# EAGLE design MICRO_SQUARED_SENSING_WITH_DIODES (EAGLE 7.5.0)
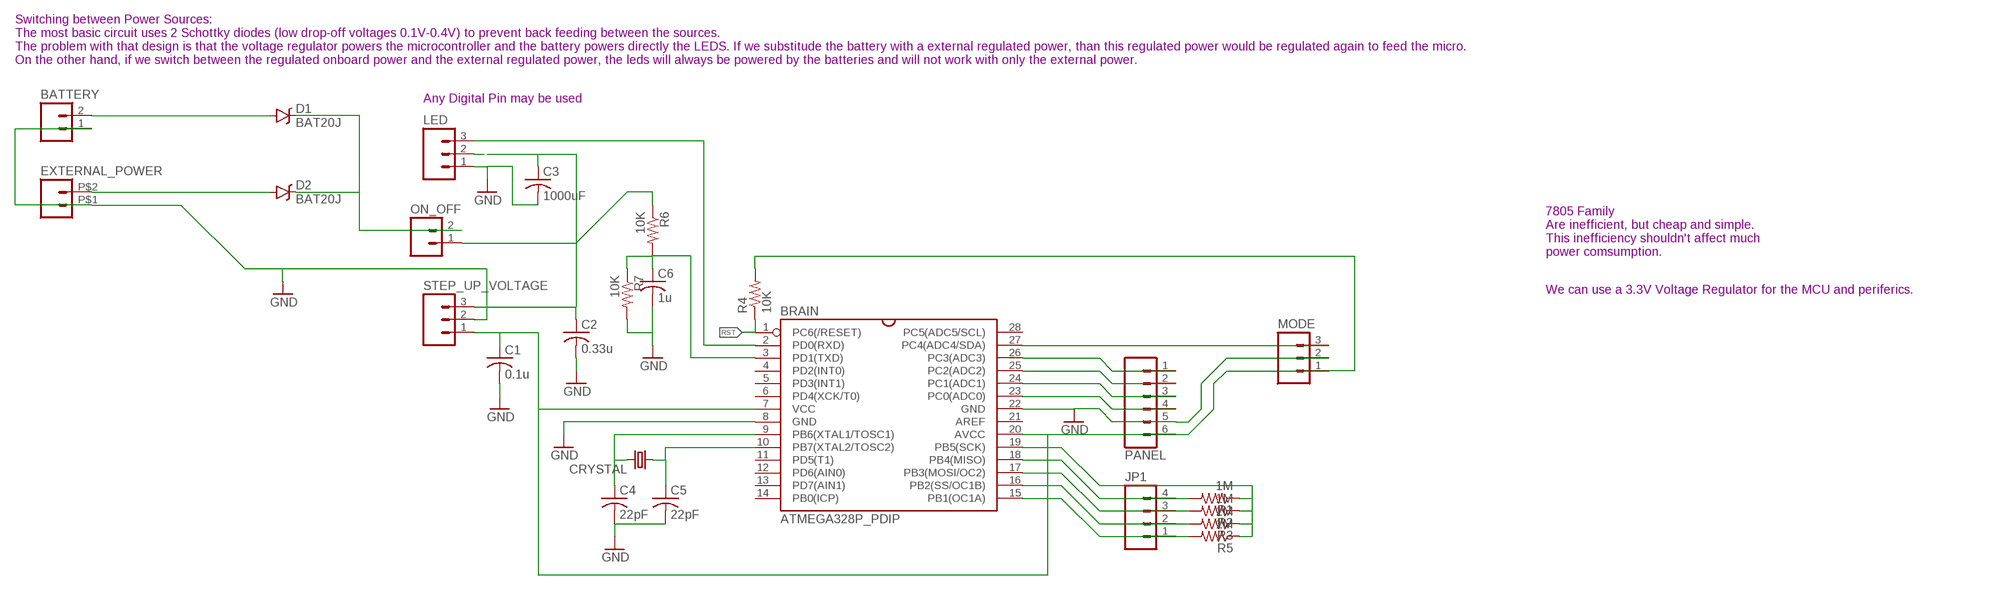
[diagram p0: schematic, sheet 1]

## Parts
BATTERY  M02PTH  [1X02]
BRAIN  ATMEGA328P_PDIP  [DIL-28-3]
C1  0.1u  C-US025-025X050  [C025-025X050]
C2  0.33u  C-US025-025X050  [C025-025X050]
C3  1000uF  C-US050-075X075  [C050-075X075]
C4  22pF  C-US025-024X044  [C025-024X044]
C5  22pF  C-US025-024X044  [C025-024X044]
C6  1u  C-US025-025X050  [C025-025X050]
CRYSTAL  CRYSTALHC49US  [HC49US]
D1  BAT20J  DIODE-SCHOTTKY-BAT20J  [SOD-323]
D2  BAT20J  DIODE-SCHOTTKY-BAT20J  [SOD-323]
EXTERNAL_POWER  M02PTH2  [1X02_BIG]
JP1  M04PTH  [1X04]
LED  M03PTH  [1X03]
MODE  M03PTH  [1X03]
ON_OFF  M02PTH  [1X02]
PANEL  M06NO_SILK_FEMALE_PTH  [1X06_NO_SILK]
R1  1M  RESISTORAXIAL-0.3  [AXIAL-0.3]
R2  1M  RESISTORAXIAL-0.3  [AXIAL-0.3]
R3  1M  RESISTORAXIAL-0.3  [AXIAL-0.3]
R4  10K  RESISTORAXIAL-0.3  [AXIAL-0.3]
R5  1M  RESISTORAXIAL-0.3  [AXIAL-0.3]
R6  10K  RESISTORAXIAL-0.3  [AXIAL-0.3]
R7  10K  RESISTORAXIAL-0.3  [AXIAL-0.3]
STEP_UP_VOLTAGE  M03PTH  [1X03]

## Nets
BLUE_BRAIN: BRAIN.25(PC2(ADC2)) PANEL.2
GND: BATTERY.1 BRAIN.8(GND) BRAIN.22(GND) C1.2 C2.2 C3.2 C4.2 C5.2 C6.2 EXTERNAL_POWER.P$1 LED.1 MODE.2 PANEL.5 R7.P$2 STEP_UP_VOLTAGE.2
GREEN_BRAIN: BRAIN.24(PC1(ADC1)) PANEL.3
LEDS_BRAIN: BRAIN.2(PD0(RXD)) LED.3
N$1: BRAIN.3(PD1(TXD)) C6.1 R6.P$2 R7.P$1
N$2: BRAIN.15(PB1(OC1A)) JP1.1 R5.P$2
N$3: BRAIN.16(PB2(SS/OC1B)) JP1.2 R3.P$2
N$4: BRAIN.17(PB3(MOSI/OC2)) JP1.3 R2.P$2
N$5: BRAIN.18(PB4(MISO)) JP1.4 R1.P$2
N$6: BRAIN.19(PB5(SCK)) R1.P$1 R2.P$1 R3.P$1 R5.P$1
N$7: BRAIN.9(PB6(XTAL1/TOSC1)) C4.1 CRYSTAL.2
N$8: BRAIN.10(PB7(XTAL2/TOSC2)) C5.1 CRYSTAL.1
N$10: D2.A EXTERNAL_POWER.P$2
N$11: BATTERY.2 D1.A
N$12: D1.C D2.C ON_OFF.2
PANEL_MODE_BRAIN: BRAIN.27(PC4(ADC4/SDA)) MODE.3
RED_BRAIN: BRAIN.26(PC3(ADC3)) PANEL.1
RST: BRAIN.1(PC6(/RESET)) R4.P$1
SPEED_BRAIN: BRAIN.23(PC0(ADC0)) PANEL.4
SWITCH_BRAIN: C2.1 C3.1 LED.2 ON_OFF.1 R6.P$1 STEP_UP_VOLTAGE.3
V_5V: BRAIN.7(VCC) BRAIN.20(AVCC) C1.1 MODE.1 PANEL.6 R4.P$2 STEP_UP_VOLTAGE.1
Unconnected: BRAIN.4(PD2(INT0)) BRAIN.5(PD3(INT1)) BRAIN.6(PD4(XCK/T0)) BRAIN.11(PD5(T1)) BRAIN.12(PD6(AIN0)) BRAIN.13(PD7(AIN1)) BRAIN.14(PB0(ICP)) BRAIN.21(AREF) BRAIN.28(PC5(ADC5/SCL))

## Notes on the sheet
- Switching between Power Sources:
  The most basic circuit uses 2 Schottky diodes (low drop-off voltages 0.1V-0.4V) to prevent back feeding between the sources.
  The problem with that design is that the voltage regulator powers the microcontroller and the battery powers directly the LEDS. If we substitude the battery with a external regulated power, than this regulated power would be regulated again to feed the micro.
  On the other hand, if we switch between the regulated onboard power and the external regulated power, the leds will always be powered by the batteries and will not work with only the external power.
- Any Digital Pin may be used
- 7805 Family
  Are inefficient, but cheap and simple.
  This inefficiency shouldn't affect much
  power comsumption.
- We can use a 3.3V Voltage Regulator for the MCU and periferics.

## Library data of the parts
BATTERY EXTERNAL_POWER ON_OFF = SparkFun-Connectors:M02: Standard 2-pin 0.1" header. Use with - straight break away headers ( PRT-00116) - right angle break away headers (PRT-00553) - swiss pins (PRT-00743) - machine pins (PRT-00117) - female headers (PRT-00115) Molex polarized connector foot print use with: PRT-08233 with associated crimp pins and housings. 2.54_SCREWTERM for use with PRT-10571. 3.5mm Screw Terminal footprints for PRT-08084 5mm Screw Terminal footprints for use with PRT-08432
BRAIN = RodrigoMarques_Parts:ATMEGA328P_PDIP: uC used in the Arduino 32kb flash, 1k EEPROM, 2k SRAM This is the through-hole version of this chip.
C1-C6 = adafruit:C-US: CAPACITOR, American symbol
CRYSTAL = SparkFun-FreqCtrl:CRYSTAL: Various standard crystals. Proven footprints.
D1 D2 = SparkFun-DiscreteSemi:DIODE-SCHOTTKY: Schottky diodes in SFE's production catalog BAT20J 1A 23V 0.62Vf RB751 120mA 40V 0.37Vf PMEG4005EJ 0.5A 40V 0.42Vf MBRA140 1A 40V 0.5Vf B340A 3A 40V SMA; PROD_ID: DIO-11623
JP1 = SparkFun-Connectors:M04: Header 4 Standard 4-pin 0.1" header. Use with straight break away headers (SKU : PRT-00116), right angle break away headers (PRT-00553), swiss pins (PRT-00743), machine pins (PRT-00117), and female headers (PRT-00115). Molex polarized connector foot print use with SKU : PRT-08231 with associated crimp pins and housings. 1MM SMD Version SKU: PRT-10208
LED MODE STEP_UP_VOLTAGE = SparkFun-Connectors:M03: Header 3 Standard 3-pin 0.1" header. Use with straight break away headers (SKU : PRT-00116), right angle break away headers (PRT-00553), swiss pins (PRT-00743), machine pins (PRT-00117), and female headers (PRT-00115). Molex polarized connector foot print use with SKU : PRT-08232 with associated crimp pins and housings.
PANEL = SparkFun-Connectors:M06: Header 6 Standard 6-pin 0.1" header. Use with straight break away headers (SKU : PRT-00116), right angle break away headers (PRT-00553), swiss pins (PRT-00743), machine pins (PRT-00117), and female headers (PRT-00115). Molex polarized connector foot print use with SKU : PRT-08094 with associated crimp pins and housings. NOTES ON THE VARIANTS LOCK and LOCK_LONGPADS... This footprint was designed to help hold the alignment of a through-hole component (i.e. 6-pin header) while soldering it into place. You may notice that each hole has been shifted either up or down by 0.005 of an inch from it's more standard position (which is a perfectly straight line). This slight alteration caused the pins (the squares in the middle) to touch the edges of the holes. Because they are alternating, it causes a "brace" to hold the component in place. 0.005 has proven to be the perfect amount of "off-center" position when using our standard breakaway headers. Although looks a little odd when you look at the bare footprint, once you have a header in there, the alteration is very hard to notice. Also,if you push a header all the way into place, it is covered up entirely on the bottom side. This idea of altering the position of holes to aid alignment will be further integrated into the Sparkfun Library for other footprints. It can help hold any component with 3 or more connection pins.; PROD_ID: CONN-08437
R1-R7 = SparkFun-Passives:RESISTOR: Resistor Basic schematic elements and footprints for 0603, 1206, and PTH resistors.

## Net classes
0 default: width 0.254 mm

## Board
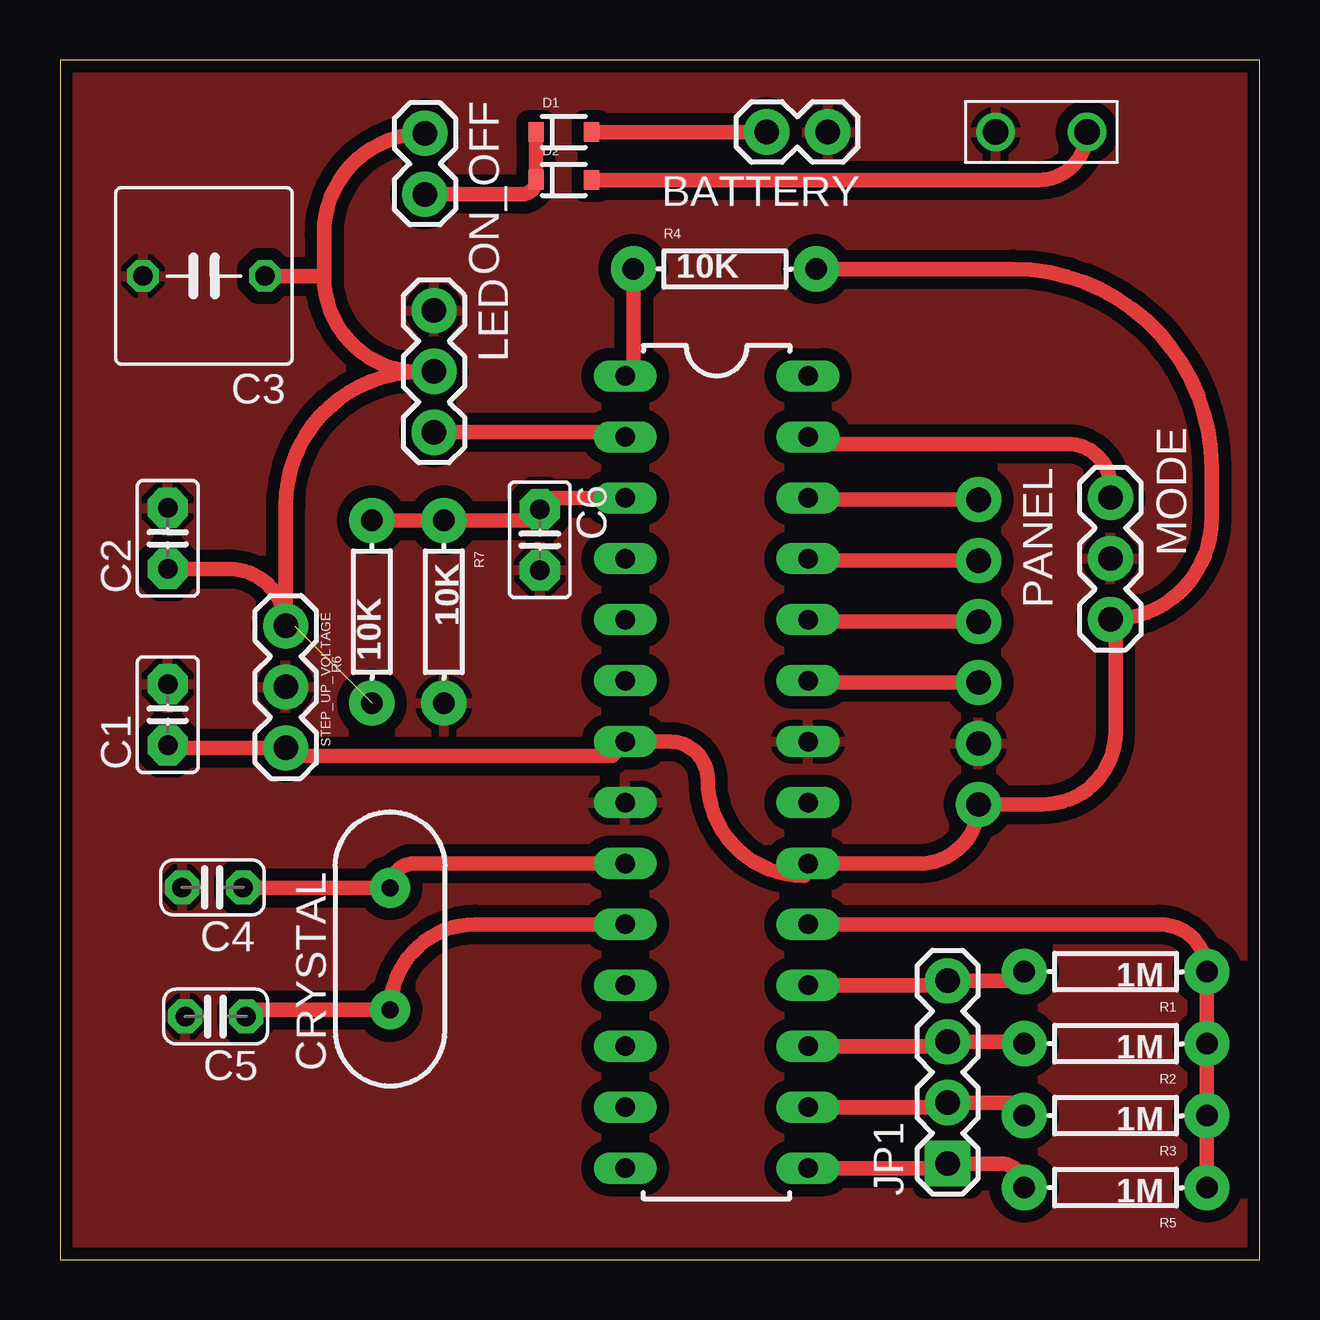
[diagram p1: board, top side]
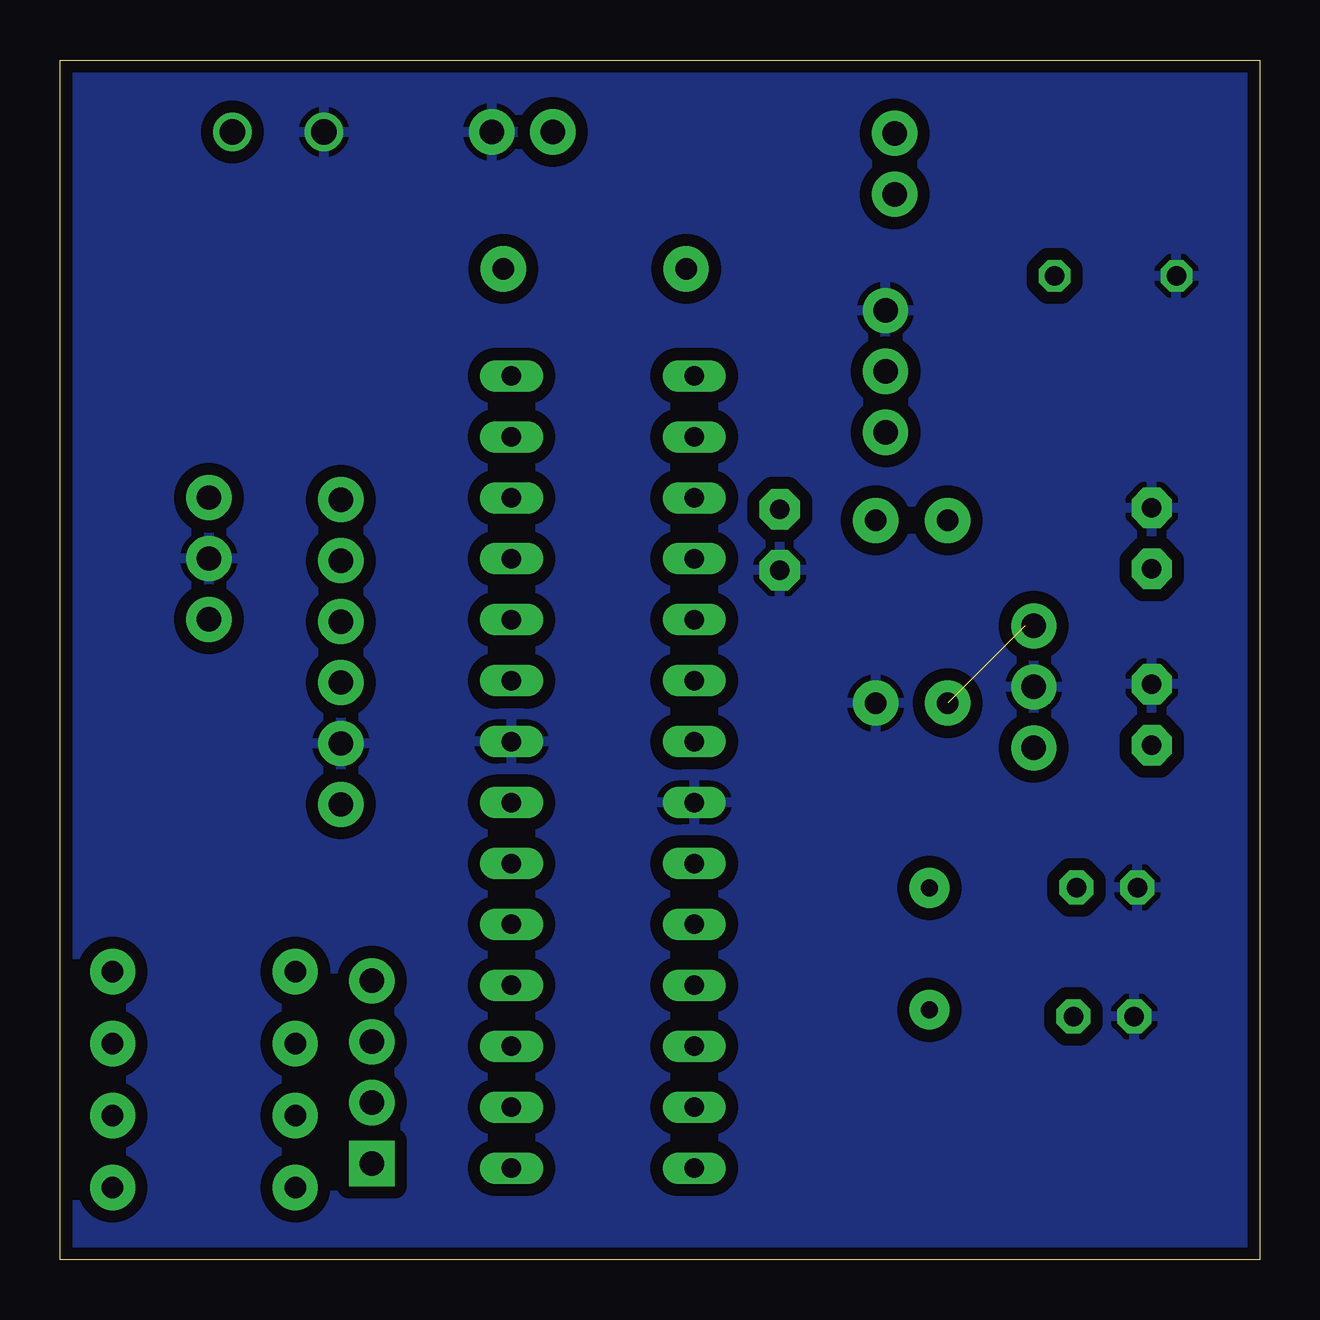
[diagram p2: board, bottom side, seen from below]

Size 50 x 50 mm. Coordinates in mm from the lower left corner, seen from the top.
Outline: 0,0 50,0 50,50 0,50 0,0
Copper layers (1*16): Top 0.035mm / dielectric 1.5mm / Bottom 0.035mm
Design rules "default *": minimum track width 10mil, minimum drill 24mil, track to track 20mil, track to pad 20mil, pad to pad 20mil, via to via 20mil, smd to smd 8mil, copper to edge 20mil, drill to drill 8mil, minimum pad ring 10mil, minimum via ring 8mil, stop-mask expansion 4mil, vias tented up to drill 0mil, thermal gap 10mil

### Footprints (pad centres in the part's own frame; a part is rotated, then mirrored left to right if it is on the bottom)
1X02 = drill 1.016 pad 1.88: 1 0,0; 2 2.54,0
DIL-28-3 = drill 0.813 long: 1 -16.51,-3.81; 2 -13.97,-3.81; 3 -11.43,-3.81; 4 -8.89,-3.81; 5 -6.35,-3.81; 6 -3.81,-3.81; 7 -1.27,-3.81; 8 1.27,-3.81; 9 3.81,-3.81; 10 6.35,-3.81; 11 8.89,-3.81; 12 11.43,-3.81; 13 13.97,-3.81; 14 16.51,-3.81; 15 16.51,3.81; 16 13.97,3.81; 17 11.43,3.81; 18 8.89,3.81; 19 6.35,3.81; 20 3.81,3.81; 21 1.27,3.81; 22 -1.27,3.81; 23 -3.81,3.81; 24 -6.35,3.81; 25 -8.89,3.81; 26 -11.43,3.81; 27 -13.97,3.81; 28 -16.51,3.81
C025-025X050 = drill 0.813 pad 1.676 octagon: 1 -1.27,0; 2 1.27,0
C050-075X075 = drill 0.813 octagon: 1 -2.54,0; 2 2.54,0
C025-024X044 = drill 0.813 pad 1.422 octagon: 1 -1.27,0; 2 1.27,0
HC49US = drill 0.7 pad 1.651: 1 -2.54,0; 2 2.54,0
SOD-323 = smd 0.63 x 0.83: A 1.15,0; C -1.15,0
1X02_BIG = drill 1.067: P$1 0,0; P$2 3.81,0
1X04 = drill 1.016 pad 1.88 square: 1 0,0 | drill 1.016 pad 1.88: 2 2.54,0; 3 5.08,0; 4 7.62,0
1X03 = drill 1.016 pad 1.88: 1 0,0; 2 2.54,0; 3 5.08,0
1X06_NO_SILK = drill 1.016 pad 1.88: 1 0,0; 2 2.54,0; 3 5.08,0; 4 7.62,0; 5 10.16,0; 6 12.7,0
AXIAL-0.3 = drill 0.9 pad 1.88: P$1 -3.81,0; P$2 3.81,0

### Placement (x,y rotation side)
BATTERY  32,47 180 top
BRAIN  27.37,20.32 270 top
C1  4.49,22.71 90 top
C2  4.49,30.06 90 top
C3  6,41 180 top
C4  6.36,15.51 180 top
C5  6.49,10.13 180 top
C6  20,30 270 top
CRYSTAL  13.76,12.95 90 top
D1  21,47 0 top
D2  21,45 0 top
EXTERNAL_POWER  39,47 0 top
JP1  37,4 90 top
LED  15.59,39.56 270 top
MODE  43.79,26.68 90 top
ON_OFF  15.21,46.94 270 top
PANEL  38.29,31.67 270 top
R1  44,12 180 top
R2  44,9 180 top
R3  44,6 180 top
R4  27.71,41.29 0 top
R5  44,3 180 top
R6  13,27 90 top
R7  16,27 270 top
STEP_UP_VOLTAGE  9.41,21.33 90 top

### Tracks (layer width: path | path; a pad name or v marks a point on that pad's centre or on a via)
BLUE_BRAIN
  Top 0.406: 31.26,29.13 arc-90 BRAIN.25
  Top 0.61: PANEL.2 31.26,29.13
GND
  pour Bottom: -9,58 -9,-9 60,-9 60,58
  pour Top: -5,54 -5,-5 56,-5 56,55 -5,55
GREEN_BRAIN
  Top 0.406: 31.26,26.59 arc-90 BRAIN.24
  Top 0.61: PANEL.3 31.26,26.59
LEDS_BRAIN
  Top 0.61: LED.3 23.37,34.48 arc-90 BRAIN.2
N$1
  Top 0.61: R6.P$2 R7.P$1 19.54,30.81 arc90 C6.1 20.48,31.75 BRAIN.3
N$2
  Top 0.61: BRAIN.15 36.81,3.81 arc90 JP1.1 39.19,4 arc-90 R5.P$2
N$3
  Top 0.61: BRAIN.16 36.81,6.35 arc90 JP1.2 39.65,6.54 arc-90 R3.P$2
N$4
  Top 0.61: BRAIN.17 36.81,8.89 arc90 JP1.3 40.11,9.08 arc-90 R2.P$2
N$5
  Top 0.61: BRAIN.18 36.81,11.43 arc90 JP1.4 39.81,11.62 arc90 R1.P$2
N$6
  Top 0.61: BRAIN.19 45.84,13.97 arc-90 R1.P$1 R2.P$1 R3.P$1 R5.P$1
N$7
  Top 0.406: C4.1 arc90 7.65,15.49
  Top 0.61: BRAIN.9 14.78,16.51 arc90 CRYSTAL.2 7.65,15.49
N$8
  Top 0.406: C5.1 arc-90 8.04,10.41
  Top 0.61: BRAIN.10 17.32,13.97 arc90 CRYSTAL.1 8.04,10.41
N$10
  Top 0.61: D2.A 40.81,45 arc90 EXTERNAL_POWER.P$2
N$11
  Top 0.61: D1.A BATTERY.2
N$12
  Top 0.61: ON_OFF.2 19.25,44.4 arc90 D2.C D1.C
PANEL_MODE_BRAIN
  Top 0.61: MODE.3 43.79,32.21 arc90 42,34 31.47,34 arc-90 BRAIN.27
RED_BRAIN
  Top 0.406: 31.26,31.67 arc-90 BRAIN.26
  Top 0.61: PANEL.1 31.26,31.67
RST
  Top 0.61: R4.P$1 23.9,37.17 arc-90 BRAIN.1
SPEED_BRAIN
  Top 0.61: PANEL.4 31.26,24.05 arc-90 BRAIN.23
SWITCH_BRAIN  (1 unrouted)
  Top 0.61: 11,41 arc90 15,37 | 15,37 15.57,37 arc90 LED.2 | C3.1 11,41 | STEP_UP_VOLTAGE.3 9.78,26.41 | C2.1 7.03,28.79 arc-90 STEP_UP_VOLTAGE.3 | STEP_UP_VOLTAGE.3 9.41,31.41 arc-90 15,37 | ON_OFF.1 arc90 11,42.73 11,41
V_5V
  Top 0.406: 44,26.47 arc90 MODE.1 | 31,16.33 arc-90 BRAIN.20
  Top 0.61: BRAIN.20 35.83,16.51 arc90 PANEL.6 40.97,18.97 arc90 44,22 44,26.47 | R4.P$2 39.71,41.29 arc-90 48,33 48,30.89 arc-90 MODE.1 | 31,16.33 31,16 arc-90 27,20 arc90 25.41,21.59 BRAIN.7 23.56,21.56 23,21 9.74,21 STEP_UP_VOLTAGE.1 4.6,21.33 C1.1